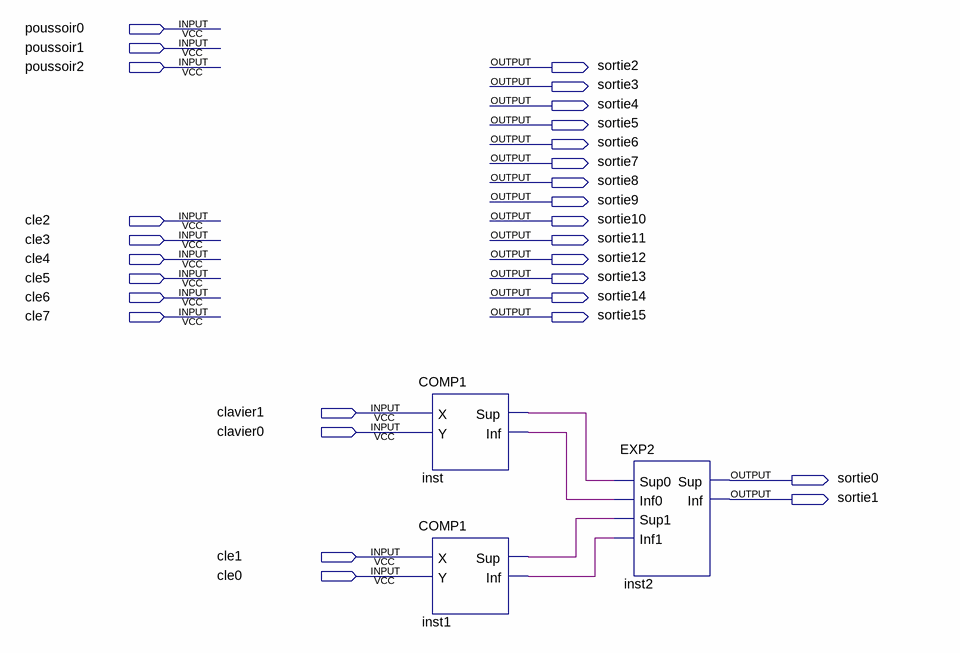
[diagram p0: schematic sheet]
// Quartus schematic fpga1.bdf as structural Verilog: 3 symbols, 29 pins
module fpga1 (
  input  poussoir0,
  input  poussoir1,
  input  poussoir2,
  input  cle2,
  input  cle3,
  input  cle4,
  input  cle5,
  input  cle6,
  input  cle7,
  input  clavier1,
  input  clavier0,
  input  cle1,
  input  cle0,
  output sortie2,
  output sortie3,
  output sortie4,
  output sortie5,
  output sortie6,
  output sortie7,
  output sortie8,
  output sortie9,
  output sortie10,
  output sortie11,
  output sortie12,
  output sortie13,
  output sortie14,
  output sortie15,
  output sortie0,
  output sortie1
);

  wire inst1_inf, inst1_sup, inst_inf, inst_sup;

  COMP1 inst (.X(clavier1), .Y(clavier0), .Sup(inst_sup), .Inf(inst_inf));
  COMP1 inst1 (.X(cle1), .Y(cle0), .Sup(inst1_sup), .Inf(inst1_inf));
  EXP2 inst2 (.Sup0(inst_sup), .Inf0(inst_inf), .Sup1(inst1_sup), .Inf1(inst1_inf), .Sup(sortie0), .Inf(sortie1));
endmodule
